# Altium schematic sheet Shema_v4.SchDoc
size A4; Organization: Altium Limited; Address1: L3, 12a Rodborough Rd; Address2: Frenchs Forest; Address3: NSW; Address4: Australia 2086
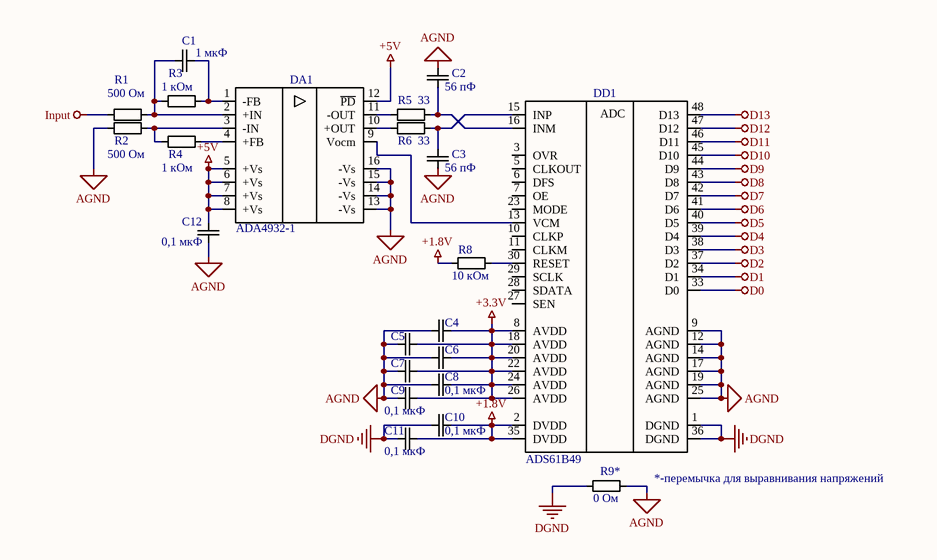
[diagram p0: Shema_v4.SchDoc]

## Parts
C1  1 мкФ  [RC0603]
C2  56 пФ  [RC0603]
C3  56 пФ  [RC0603]
C4  0,1 мкФ  [RC0402]  (value not drawn)
C5  0,1 мкФ  [RC0402]  (value not drawn)
C6  0,1 мкФ  [RC0402]  (value not drawn)
C7  0,1 мкФ  [RC0402]  (value not drawn)
C8  0,1 мкФ  [RC0402]
C9  0,1 мкФ  [RC0402]
C10  0,1 мкФ  [RC0402]
C11  0,1 мкФ  [RC0402]
C12  0,1 мкФ  [RC0402]
DA1  ADA4932-1  [QFN16]
DD1  ADS61B49  [QFN48]
R1  500 Ом  [RC0603]
R2  500 Ом  [RC0603]
R3  1 кОм  [RC0603]
R4  1 кОм  [RC0603]
R5  33  [RC0603]
R6  33  [RC0603]
R8  10 кОм  [RC0603]
R9*  0 Ом  [RC0402]

## Nets
+1.8V: C10.1 C11.1 DD1.2(DVDD) DD1.35(DVDD) R8.2
+3.3V: C4.1 C5.1 C6.1 C7.1 C8.1 C9.1 DD1.8(AVDD) DD1.18(AVDD) DD1.20(AVDD) DD1.22(AVDD) DD1.24(AVDD) DD1.26(AVDD)
+5V: C12.1 DA1.5(+Vs) DA1.6(+Vs) DA1.7(+Vs) DA1.8(+Vs) DA1.12(~{PD})
AGND: C2.2 C3.1 C4.2 C5.2 C6.2 C7.2 C8.2 C9.2 C12.2 DA1.13(-Vs) DA1.14(-Vs) DA1.15(-Vs) DA1.16(-Vs) DD1.9(AGND) DD1.12(AGND) DD1.14(AGND) DD1.17(AGND) DD1.19(AGND) DD1.25(AGND) R2.2 R9*.1
D0: DD1.33(D0)
D1: DD1.34(D1)
D2: DD1.37(D2)
D3: DD1.38(D3)
D4: DD1.39(D4)
D5: DD1.40(D5)
D6: DD1.41(D6)
D7: DD1.42(D7)
D8: DD1.43(D8)
D9: DD1.44(D9)
D10: DD1.45(D10)
D11: DD1.46(D11)
D12: DD1.47(D12)
D13: DD1.48(D13)
DGND: C10.2 C11.2 DD1.1(DGND) DD1.36(DGND) R9*.2
Input: R1.1
NetC1_1: C1.1 DA1.2(+IN) R1.2 R3.1
NetC1_2: C1.2 DA1.1(-FB) R3.2
NetC2_1: C2.1 DD1.16(INM) R5.2
NetC3_2: C3.2 DD1.15(INP) R6.2
NetDA1_3: DA1.3(-IN) R2.1 R4.1
NetDA1_4: DA1.4(+FB) R4.2
NetDA1_9: DA1.9(Vocm) DD1.13(VCM)
NetDA1_10: DA1.10(+OUT) R6.1
NetDA1_11: DA1.11(-OUT) R5.1
NetDD1_30: DD1.30(RESET) R8.1

Not connected (* = marked no-connect by the designer): DD1 3(OVR) 5(CLKOUT) 6(DFS) 7(OE) 10(CLKP) 11(CLKM) 23(MODE) 27(SEN) 28(SDATA) 29(SCLK)

## Notes on the sheet
- *-перемычка для выравнивания напряжений
- Title
- Size:
- Date:
- A4
- Number:
- Time:
- Revision:
- Sheet
- of
- File:
- (in symbol ADS61B49) ADC

## Library data of the parts
C1-C12 = Capacitor: Конденсатор
DA1 = ADA4932-1: Операционный усилитель для АЦП
DD1 = ADS61B49: 14-бит АЦП
R1-R6 R8 R9* = Resistor: Резистор